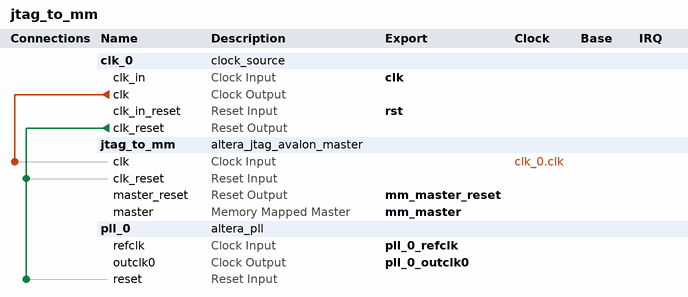
[diagram p0: system contents]
# Platform Designer (Qsys) system jtag_to_mm, Cyclone V 5CSXFC6D6F31I7
# Parameters at their usual value, and those the tool derives, are not listed.
package require -exact qsys 19.1
create_system jtag_to_mm
set_project_property DEVICE_FAMILY {Cyclone V}
set_project_property DEVICE 5CSXFC6D6F31I7

add_instance clk_0 clock_source 19.1
set_instance_parameter_value clk_0 clockFrequency 125000000

add_instance jtag_to_mm altera_jtag_avalon_master 19.1

add_instance pll_0 altera_pll 19.1
set_instance_parameter_value pll_0 gui_device_speed_grade 1
set_instance_parameter_value pll_0 gui_number_of_clocks 1
set_instance_parameter_value pll_0 gui_operation_mode direct
set_instance_parameter_value pll_0 gui_output_clock_frequency0 125.0
set_instance_parameter_value pll_0 gui_pll_mode {Integer-N PLL}
set_instance_parameter_value pll_0 gui_ps_units0 degrees
set_instance_parameter_value pll_0 gui_reference_clock_frequency 125.0
set_instance_parameter_value pll_0 gui_use_locked true

# connections
add_connection clk_0.clk jtag_to_mm.clk clock
add_connection clk_0.clk_reset jtag_to_mm.clk_reset reset
add_connection clk_0.clk_reset pll_0.reset reset

# exported interfaces
add_interface clk clock sink
set_interface_property clk EXPORT_OF clk_0.clk_in
add_interface mm_master avalon master
set_interface_property mm_master EXPORT_OF jtag_to_mm.master
add_interface mm_master_reset reset source
set_interface_property mm_master_reset EXPORT_OF jtag_to_mm.master_reset
add_interface pll_0_outclk0 clock source
set_interface_property pll_0_outclk0 EXPORT_OF pll_0.outclk0
add_interface pll_0_refclk clock sink
set_interface_property pll_0_refclk EXPORT_OF pll_0.refclk
add_interface rst reset sink
set_interface_property rst EXPORT_OF clk_0.clk_in_reset

set_interconnect_requirement {$system} qsys_mm.clockCrossingAdapter HANDSHAKE
set_interconnect_requirement {$system} qsys_mm.enableEccProtection FALSE
set_interconnect_requirement {$system} qsys_mm.insertDefaultSlave FALSE
set_interconnect_requirement {$system} qsys_mm.maxAdditionalLatency 1

save_system jtag_to_mm.qsys
